# EAGLE design sensorboard-ext (EAGLE 5.05)
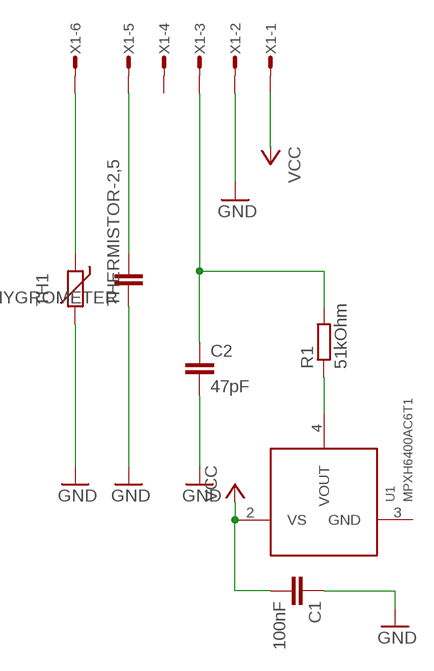
[diagram p0: schematic, sheet 1]

## Parts
C1  100nF  C-EUC0805  [C0805]
C2  47pF  C-EUC0805  [C0805]
HYGROMETER  C-EU025-024X044  [C025-024X044]
R1  51kOhm  R-EU_R0805  [R0805]
TH1  THERMISTOR-2,5  [RS-2,5]
U1  MPXH6400AC6T1  [SSOP8]
X1  MICROMATCH-6SM  [MMT-SMD-6]

## Nets
GND: C1.1 C2.2 HYGROMETER.1 TH1.2 X1.2
N$1: HYGROMETER.2 X1.5
N$2: TH1.1 X1.6
N$3: C2.1 R1.2 X1.3
N$5: R1.1 U1.4(VOUT)
VCC: C1.2 U1.2(VS) X1.1
Unconnected: U1.1(NC) U1.5(NC) U1.6(NC) U1.7(NC) U1.8(NC) X1.4

## Power pins joined to a net without a drawn wire
GND: U1.3(GND)

## Library data of the parts
C1 C2 HYGROMETER = resistor:C-EU: CAPACITOR, European symbol
R1 = resistor:R-EU_: RESISTOR, European symbol
TH1 = varistor:THERMISTOR: THERMISTOR
U1 = mpxh6400:MPXH6400A
X1 = con-amp-micromatch:MICROMATCH-6: MicroMaTch 6 7-215464-6 / 0-215464-6 Drawing Number C-215464 DDEController.pdf

## Board
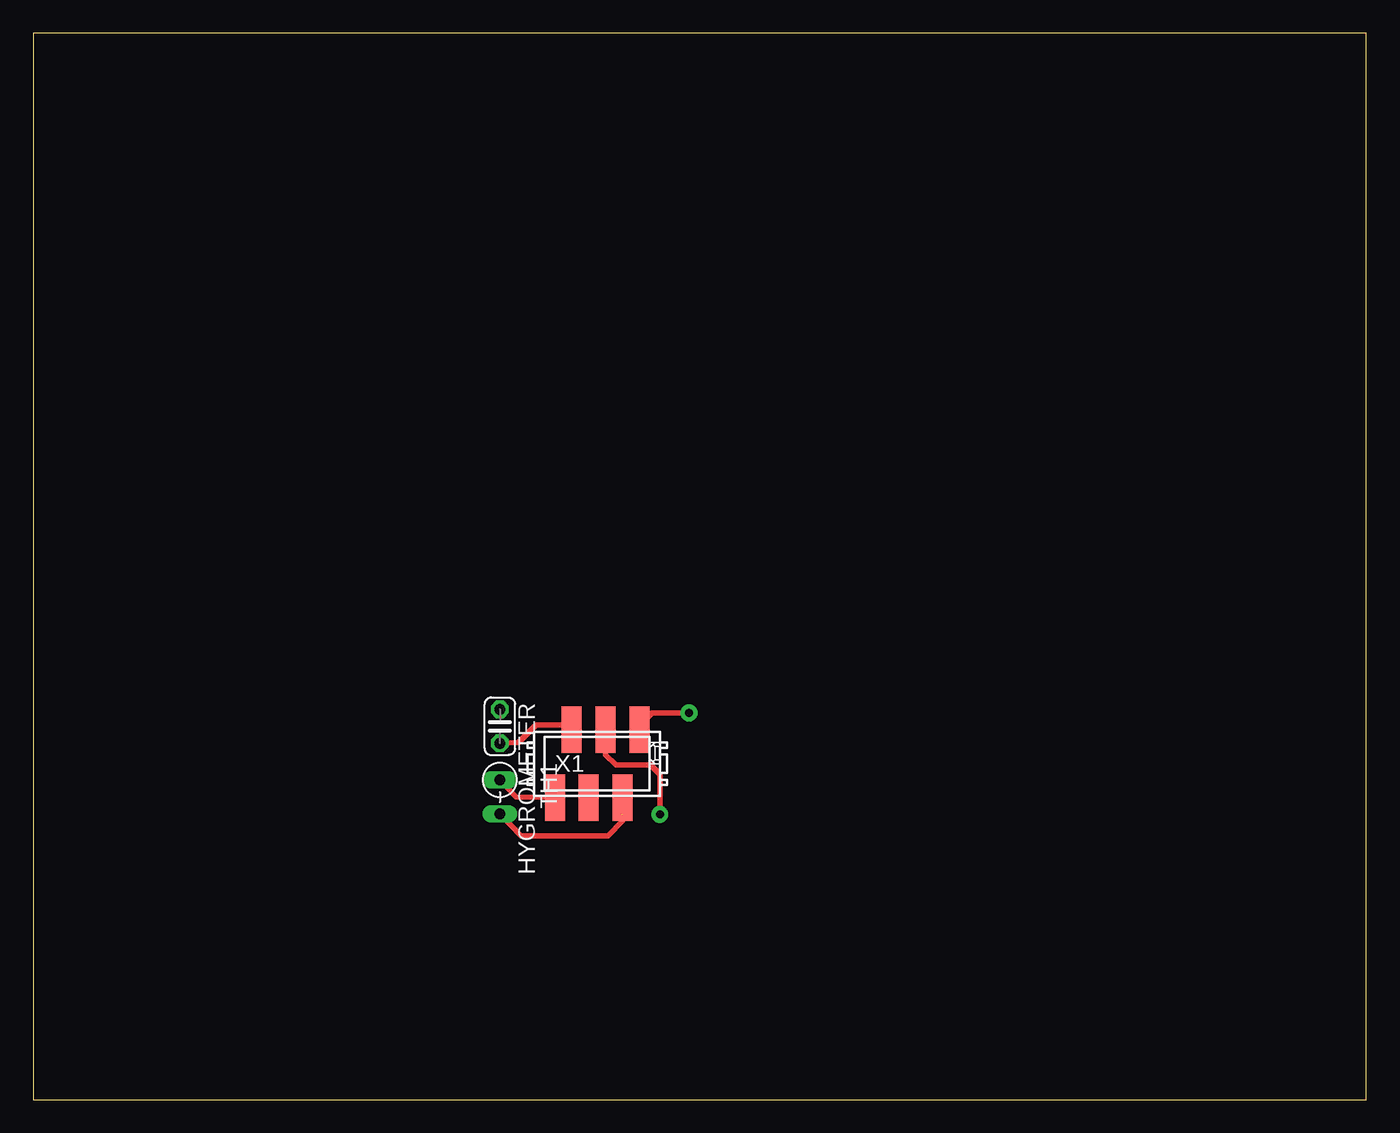
[diagram p1: board, top side]
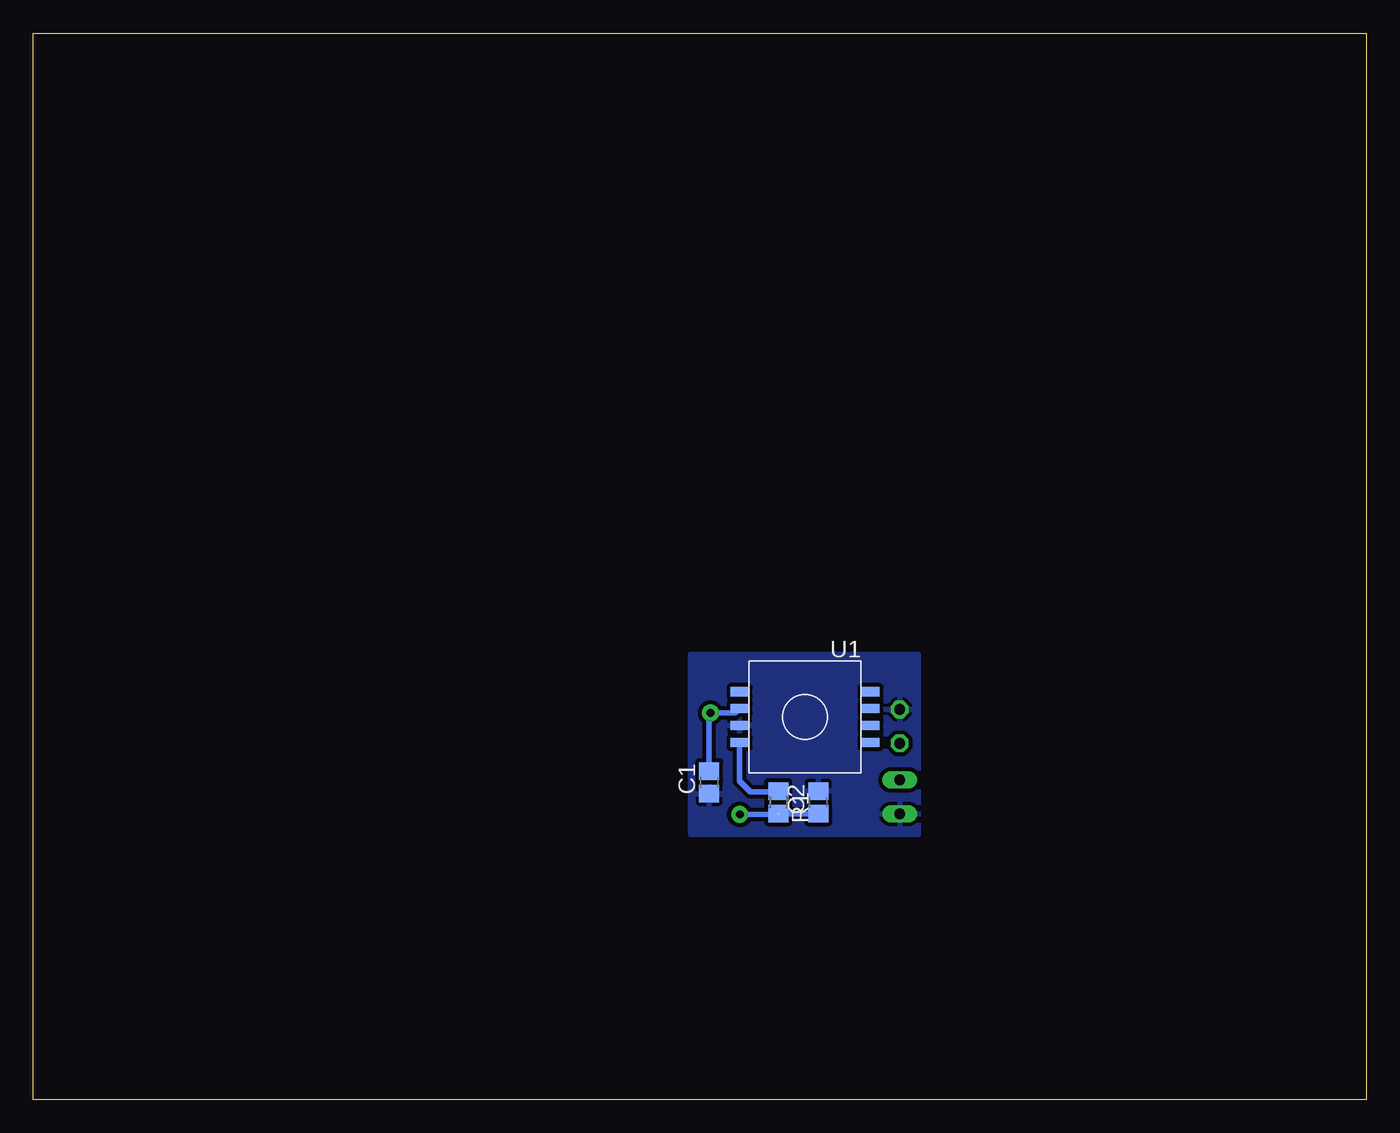
[diagram p2: board, bottom side, seen from below]

Size 100 x 80 mm. Coordinates in mm from the lower left corner, seen from the top.
Outline: 0,0 100,0 100,80 0,80 0,0
Copper layers (1*16): Top 0.035mm / dielectric 1.5mm / Bottom 0.035mm
Design rules "default *": minimum track width 10mil, minimum drill 0.6mm, track to track 12mil, track to pad 12mil, pad to pad 12mil, via to via 12mil, smd to smd 8mil, copper to edge 40mil, drill to drill 8mil, minimum pad ring 10mil, minimum via ring 8mil, stop-mask expansion 4mil, vias tented up to drill 0mil, thermal gap 10mil

### Footprints (pad centres in the part's own frame; a part is rotated, then mirrored left to right if it is on the bottom)
C0805 = smd 1.3 x 1.5: 1 -0.85,0; 2 0.85,0
C025-024X044 = drill 0.813 octagon: 1 -1.27,0; 2 1.27,0
R0805 = smd 1.3 x 1.5: 1 -0.85,0; 2 0.85,0
RS-2,5 = drill 0.813 long: 1 -1.27,0; 2 1.27,0
SSOP8 = smd 1.346 x 0.686: 1 4.915,-1.905; 2 4.915,-0.635; 3 4.915,0.635; 4 4.915,1.905; 5 -4.915,1.905; 6 -4.915,0.635; 7 -4.915,-0.635; 8 -4.915,-1.905
MMT-SMD-6 = smd 1.5 x 3.5: 1 3.175,2.54; 2 1.905,-2.54; 3 0.635,2.54; 4 -0.635,-2.54; 5 -1.905,2.54; 6 -3.175,-2.54

### Placement (x,y rotation side)
C1  49.3,23.8 90 bottom
C2  41.1,22.3 90 bottom
HYGROMETER  35,28 270 top
R1  44.1,22.3 270 bottom
TH1  35,22.7 270 top
U1  42.1,28.7 180 bottom
X1  42.3,25.2 0 top

### Tracks (layer width: path | path; a pad name or v marks a point on that pad's centre or on a via)
GND
  Top 0.406: X1.2 44.2,20.9 43.1,19.8 36.6,19.8 TH1.2
  pour Bottom: 33.6,33.1 33.6,19.9 50.7,19.9 50.7,33.4 33.6,33.4
N$1
  Top 0.406: HYGROMETER.2 36.4,26.8 37.7,28.1 40,28.1 X1.5
N$2
  Top 0.406: X1.6 36.2,22.7 TH1.1
N$3  (via drill 0.6 pad 1.27)  (1 unrouted)
  Top 0.406: X1.3 42.94,25.86 43.7,25.1 46.3,25.1 47,24.4 v47,21.4
  Bottom 0.406: 44.15,21.4 v47,21.4 | C2.1 R1.2
N$5
  Bottom 0.406: R1.1 44.15,23.1 46.2,23.1 47.02,23.91 U1.4
VCC  (via drill 0.6 pad 1.27)
  Top 0.406: X1.1 45.48,28.07 45.6,28.2 46.4,29 v49.2,29
  Bottom 0.406: U1.2 47.35,29 v49.2,29 49.3,28.9 C1.2